# EAGLE design 18650_1S3P_Smart (EAGLE 9.6.2)
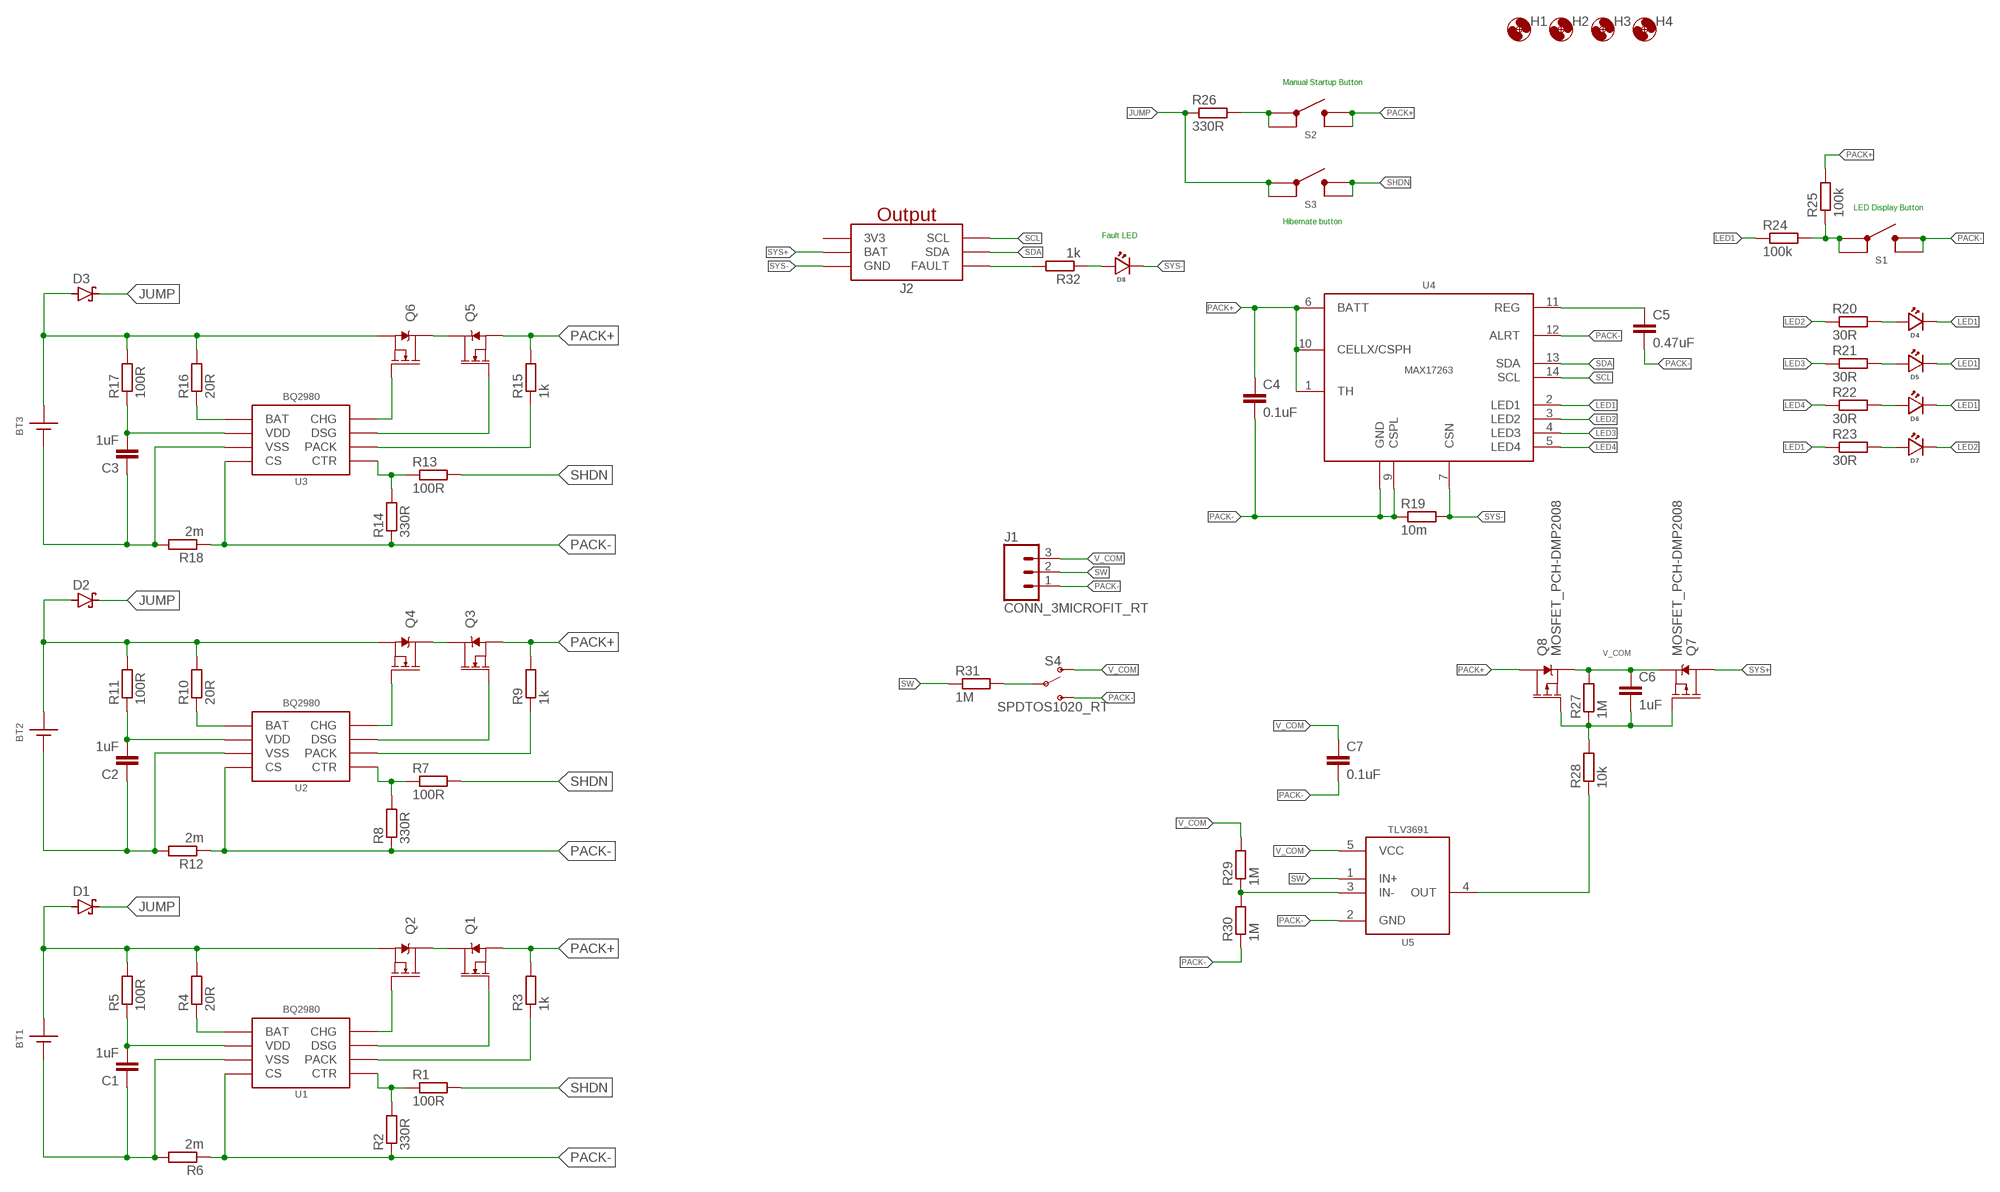
[diagram p0: schematic, sheet 1]

## Parts
BT1  186501042P_NOSILK  [BATT_1042P_NOSILK]
BT2  186501042P_NOSILK  [BATT_1042P_NOSILK]
BT3  186501042P_NOSILK  [BATT_1042P_NOSILK]
C1  1uF  C-EU1UFC0603  [C0603]
C2  1uF  C-EU1UFC0603  [C0603]
C3  1uF  C-EU1UFC0603  [C0603]
C4  0.1uF  C-EU0.1UFC0603  [C0603]
C5  0.47uF  C-EU0.47UFC0603  [C0603]
C6  1uF  C-EU1UFC0603  [C0603]
C7  0.1uF  C-EU0.1UFC0603  [C0603]
D1  DIODE_SCHOTTKYSOD-323  [SOD323-R]
D2  DIODE_SCHOTTKYSOD-323  [SOD323-R]
D3  DIODE_SCHOTTKYSOD-323  [SOD323-R]
D4  LED1206_BOTTOM  [LED_1206_BOTTOM]
D5  LED1206_BOTTOM  [LED_1206_BOTTOM]
D6  LED1206_BOTTOM  [LED_1206_BOTTOM]
D7  LED1206_BOTTOM  [LED_1206_BOTTOM]
D8  LED1206_BOTTOM  [LED_1206_BOTTOM]
H1  MOUNTING_HOLE2_NP  [2_56]
H2  MOUNTING_HOLE2_NP  [2_56]
H3  MOUNTING_HOLE2_NP  [2_56]
H4  MOUNTING_HOLE2_NP  [2_56]
J1  CONN_3MICROFIT_RT  [1X3_MICROFIT_RT]
J2  GEMS_POWER_PLUGOUTPUT  [2X3_MICROFIT_RT]
Q1  MOSFET-NCH-AON7522E  [DFN3X3A_8L_EP1_P]
Q2  MOSFET-NCH-AON7522E  [DFN3X3A_8L_EP1_P]
Q3  MOSFET-NCH-AON7522E  [DFN3X3A_8L_EP1_P]
Q4  MOSFET-NCH-AON7522E  [DFN3X3A_8L_EP1_P]
Q5  MOSFET-NCH-AON7522E  [DFN3X3A_8L_EP1_P]
Q6  MOSFET-NCH-AON7522E  [DFN3X3A_8L_EP1_P]
Q7  MOSFET_PCH-DMP2008  [POWERDI3333-8]
Q8  MOSFET_PCH-DMP2008  [POWERDI3333-8]
R1  100R  R-EU_100R0603  [R0603]
R2  330R  R-EU_330R0603  [R0603]
R3  1k  R-EU_1KR0603  [R0603]
R4  20R  R-EU_20R0603  [R0603]
R5  100R  R-EU_100R0603  [R0603]
R6  2m  R-EU_0.002R0805  [R0805]
R7  100R  R-EU_100R0603  [R0603]
R8  330R  R-EU_330R0603  [R0603]
R9  1k  R-EU_1KR0603  [R0603]
R10  20R  R-EU_20R0603  [R0603]
R11  100R  R-EU_100R0603  [R0603]
R12  2m  R-EU_0.002R0805  [R0805]
R13  100R  R-EU_100R0603  [R0603]
R14  330R  R-EU_330R0603  [R0603]
R15  1k  R-EU_1KR0603  [R0603]
R16  20R  R-EU_20R0603  [R0603]
R17  100R  R-EU_100R0603  [R0603]
R18  2m  R-EU_0.002R0805  [R0805]
R19  10m  R-EU_0.01R0805  [R0805]
R20  30R  R-EU_30R0603  [R0603]
R21  30R  R-EU_30R0603  [R0603]
R22  30R  R-EU_30R0603  [R0603]
R23  30R  R-EU_30R0603  [R0603]
R24  100k  R-EU_100KR0603  [R0603]
R25  100k  R-EU_100KR0603  [R0603]
R26  330R  R-EU_330R0603  [R0603]
R27  1M  R-EU_1MR0603  [R0603]
R28  10k  R-EU_10KR0603  [R0603]
R29  1M  R-EU_1MR0603  [R0603]
R30  1M  R-EU_1MR0603  [R0603]
R31  1M  R-EU_1MR0603  [R0603]
R32  1k  R-EU_1KR0603  [R0603]
S1  BUTTON6X6_TH  [SWITCH_6MM_TH]
S2  BUTTON6X6_TH  [SWITCH_6MM_TH]
S3  BUTTON6X6_TH  [SWITCH_6MM_TH]
S4  SPDTOS1020_RT  [OS102011MA1QN1]
U1  BQ2980RUG  [RUG_S-PQFP-N8]
U2  BQ2980RUG  [RUG_S-PQFP-N8]
U3  BQ2980RUG  [RUG_S-PQFP-N8]
U4  MAX17263  [DFN_14_3X3]
U5  TLV3691DCK  [DCK_R-PDSO-G5]

## Nets
JUMP: D1.C D2.C D3.C R26.1 S3.1 S3.2
LED1: D4.CATHODE D5.CATHODE D6.CATHODE R23.1 R24.1 U4.2(LED1)
LED2: D7.CATHODE R20.1 U4.3(LED2)
LED3: R21.1 U4.4(LED3)
LED4: R22.1 U4.5(LED4)
N$1: Q1.D Q2.D
N$2: Q2.G U1.8(CHG)
N$3: Q1.G U1.7(DSG)
N$4: R1.1 R2.2 U1.5(CTR)
N$5: R3.1 U1.6(PACK)
N$6: BT1.BATT+(+) D1.A Q2.S@1(S) Q2.S@2(S) Q2.S@3(S) R4.2 R5.2
N$7: C1.2 R5.1 U1.2(VDD)
N$8: R4.1 U1.1(BAT)
N$9: BT1.BATT-(-) C1.1 R6.2 U1.3(VSS)
N$10: Q3.D Q4.D
N$11: Q4.G U2.8(CHG)
N$12: Q3.G U2.7(DSG)
N$13: R9.1 U2.6(PACK)
N$14: R7.1 R8.2 U2.5(CTR)
N$15: BT2.BATT+(+) D2.A Q4.S@1(S) Q4.S@2(S) Q4.S@3(S) R10.2 R11.2
N$16: C2.2 R11.1 U2.2(VDD)
N$17: R10.1 U2.1(BAT)
N$18: BT2.BATT-(-) C2.1 R12.2 U2.3(VSS)
N$19: Q5.D Q6.D
N$20: Q6.G U3.8(CHG)
N$21: Q5.G U3.7(DSG)
N$22: R15.1 U3.6(PACK)
N$23: R13.1 R14.2 U3.5(CTR)
N$24: BT3.BATT+(+) D3.A Q6.S@1(S) Q6.S@2(S) Q6.S@3(S) R16.2 R17.2
N$25: C3.2 R17.1 U3.2(VDD)
N$26: R16.1 U3.1(BAT)
N$27: BT3.BATT-(-) C3.1 R18.2 U3.3(VSS)
N$28: D4.ANODE R20.2
N$29: D5.ANODE R21.2
N$30: D6.ANODE R22.2
N$31: D7.ANODE R23.2
N$32: R24.2 R25.1 S1.1 S1.2
N$33: C5.1 U4.11(REG)
N$34: R26.2 S2.1 S2.2
N$35: R31.2 S4.2(P)
N$36: C6.2 Q7.4(G) Q8.4(G) R27.1 R28.2
N$37: R28.1 U5.4(OUT)
N$38: J2.1(FAULT) R32.2
N$41: R29.1 R30.2 U5.3(IN-)
N$42: D8.ANODE R32.1
PACK+: C4.1 Q1.S@1(S) Q1.S@2(S) Q1.S@3(S) Q3.S@1(S) Q3.S@2(S) Q3.S@3(S) Q5.S@1(S) Q5.S@2(S) Q5.S@3(S) Q8.EP@1(D) Q8.EP@2(D) Q8.EP@3(D) Q8.EP@4(D) Q8.EP@5(D) R3.2 R9.2 R15.2 R25.2 S2.3 S2.4 U4.1(TH) U4.6(BATT) U4.10(CELLX/CSPH)
PACK-: C4.2 C5.2 C7.2 J1.1 R2.1 R6.1 R8.1 R12.1 R14.1 R18.1 R19.1 R30.1 S1.3 S1.4 S4.3(S) U1.4(CS) U2.4(CS) U3.4(CS) U4.8(GND) U4.9(CSPL) U4.12(ALRT) U4.EP(GND) U5.2(GND)
SCL: J2.4(SCL) U4.14(SCL)
SDA: J2.6(SDA) U4.13(SDA)
SHDN: R1.2 R7.2 R13.2 S3.3 S3.4
SW: J1.2 R31.1 U5.1(IN+)
SYS+: J2.3(BAT) Q7.EP@1(D) Q7.EP@2(D) Q7.EP@3(D) Q7.EP@4(D) Q7.EP@5(D)
SYS-: D8.CATHODE J2.2(GND) R19.2 U4.7(CSN)
V_COM: C6.1 C7.1 J1.3 Q7.1(S) Q7.2(S) Q7.3(S) Q8.1(S) Q8.2(S) Q8.3(S) R27.2 R29.2 S4.1(O) U5.5(VCC)

## Notes on the sheet
- Manual Startup Button
- LED Display Button
- Hibernate button
- Fault LED

## Power pins joined to a net without a drawn wire
3V3: J2.5(3V3)

## Library data of the parts
BT1-BT3 = bschulz:18650: Battery Holder 18650 form factor Variant for with or without circuit protection (length varries depending on this); DIGIKEY: 36-1042P-ND; MF: Keystone; MPN: 1042P
C1-C3 C6 = bschulz_passives:C-EU: CAPACITOR, European symbol; DIGIKEY: 587-1251-1-ND; MF: Yaiyo Yuden; MPN: EMK107BJ105KA-T
C4 C7 = bschulz_passives:C-EU: CAPACITOR, European symbol; DIGIKEY: 490-6051-1-ND; MF: Murata; MPN: GCM188R71E104KA57D
C5 = bschulz_passives:C-EU: CAPACITOR, European symbol; DIGIKEY: 1276-2083-1-ND; MF: Samsung; MPN: CL10B474KA8NNNC
D1-D3 = bschulz:DIODE_SCHOTTKY: Generic Shottky Diode; DIGIKEY: BAT54WS-FDICT-ND; MF: Diodes Inc; MPN: BAT54WS-7-F
D4-D8 = bschulz:LED: Genaric LED
H1-H4 = bschulz:MOUNTING_HOLE: Genaric Mechanical Mounting Hole Hole diameter based on max body diameter + 15% Keepout ring is for diameter of socket cap screw (minimum required clearance) TPlace ring is for diameter of pan head screw (recomended clearance) Specifications: Socket Cap Button Head Socket Cap Pan Head; DIGIKEY: DNP; MF: N/A; MPN: DNP
J1 = bschulz:CONN_3: Genaric 3 terminal header Digikey 2.54_SCREW 3.5_SCREW; DIGIKEY: WM1861-ND; MF: Molex; MPN: 0436500300
J2 = bschulz:GEMS_POWER_PLUG: Power Plug For GEMS Based Systems Both Input and Output versions; DIGIKEY: WM1815-ND; DISP: Output; MF: Molex; MPN: 0430450600
Q1-Q6 = bschulz:MOSFET-NCH: N-channel MOSFETs Voltage controlled devices that allow control of high current outputs. SparkFun Products: SparkFun OpenScale <https://www.sparkfun.com/products/13261> SparkFun Digital Sandbox <https://www.sparkfun.com/products/12651> SparkFun Monster Moto Shield <https://www.sparkfun.com/products/10182> SparkFun MOSFET Power Controller <https://www.sparkfun.com/products/11214>; DIGIKEY: 785-1505-1-ND; MF: Alpha & Omega; MPN: AON7522E
Q7 Q8 = bschulz:MOSFET_PCH: P-channel MOSFETs Voltage controlled devices that allow control of high current outputs. SparkFun Products: SparkFun ESP32 Thing <https://www.sparkfun.com/products/13907> SparkFun ESP8266 Thing <https://www.sparkfun.com/products/13231>
R1 R5 R7 R11 R13 R17 = bschulz_passives:R-EU_: RESISTOR, European symbol Digikey Parts: Yageo, 0402 Yageo, 0603 Panasonic, 0603 Panasonic, precision, 0603 Panasonic, 0805 Rohm, current sense Vishay, pulse proof automotive; DIGIKEY: 311-100HRCT-ND; MF: Yageo; MPN: RC0603FR-07100RL; VALUE_PART: 100
R2 R8 R14 R26 = bschulz_passives:R-EU_: RESISTOR, European symbol Digikey Parts: Yageo, 0402 Yageo, 0603 Panasonic, 0603 Panasonic, precision, 0603 Panasonic, 0805 Rohm, current sense Vishay, pulse proof automotive; DIGIKEY: 311-330HRCT-ND; MF: Yageo; MPN: RC0603FR-07330RL; VALUE_PART: 330
R3 R9 R15 R32 = bschulz_passives:R-EU_: RESISTOR, European symbol Digikey Parts: Yageo, 0402 Yageo, 0603 Panasonic, 0603 Panasonic, precision, 0603 Panasonic, 0805 Rohm, current sense Vishay, pulse proof automotive; DIGIKEY: 311-1KLDCT-ND; MF: Yageo; MPN: AC0603FR-071KL; VALUE_PART: 1k
R4 R10 R16 = bschulz_passives:R-EU_: RESISTOR, European symbol Digikey Parts: Yageo, 0402 Yageo, 0603 Panasonic, 0603 Panasonic, precision, 0603 Panasonic, 0805 Rohm, current sense Vishay, pulse proof automotive; DIGIKEY: 311-20.0HRCT-ND; MF: Yageo; MPN: RC0603FR-0720RL; VALUE_PART: 20
R6 R12 R18 = bschulz_passives:R-EU_: RESISTOR, European symbol Digikey Parts: Yageo, 0402 Yageo, 0603 Panasonic, 0603 Panasonic, precision, 0603 Panasonic, 0805 Rohm, current sense Vishay, pulse proof automotive; DIGIKEY: RHM.002AJCT-ND; MF: Rohm; MPN: PMR10EZPFV2L00
R19 = bschulz_passives:R-EU_: RESISTOR, European symbol Digikey Parts: Yageo, 0402 Yageo, 0603 Panasonic, 0603 Panasonic, precision, 0603 Panasonic, 0805 Rohm, current sense Vishay, pulse proof automotive; DIGIKEY: CRF0805-FZ-R010ELFCT-ND; MF: Bourns; MPN: CRF0805-FZ-R010ELF
R20-R23 = bschulz_passives:R-EU_: RESISTOR, European symbol Digikey Parts: Yageo, 0402 Yageo, 0603 Panasonic, 0603 Panasonic, precision, 0603 Panasonic, 0805 Rohm, current sense Vishay, pulse proof automotive; DIGIKEY: 311-30.0HRCT-ND; MF: Yageo; MPN: RC0603FR-0730RL; VALUE_PART: 30
R24 R25 = bschulz_passives:R-EU_: RESISTOR, European symbol Digikey Parts: Yageo, 0402 Yageo, 0603 Panasonic, 0603 Panasonic, precision, 0603 Panasonic, 0805 Rohm, current sense Vishay, pulse proof automotive; DIGIKEY: 311-100KHRCT-ND; MF: Yageo; MPN: RC0603FR-07100KL; VALUE_PART: 100k
R27 R29-R31 = bschulz_passives:R-EU_: RESISTOR, European symbol Digikey Parts: Yageo, 0402 Yageo, 0603 Panasonic, 0603 Panasonic, precision, 0603 Panasonic, 0805 Rohm, current sense Vishay, pulse proof automotive; DIGIKEY: P1.00MHCT-ND; MF: Panasonic; MPN: ERJ-3EKF1004V; VALUE_PART: 1M
R28 = bschulz_passives:R-EU_: RESISTOR, European symbol Digikey Parts: Yageo, 0402 Yageo, 0603 Panasonic, 0603 Panasonic, precision, 0603 Panasonic, 0805 Rohm, current sense Vishay, pulse proof automotive; DIGIKEY: 311-10.0KHRCT-ND; MF: Yageo; MPN: RC0603FR-0710KL; VALUE_PART: 10k
S1-S3 = bschulz:BUTTON: Genaric SPST Push button; DIGIKEY: 450-1650-ND; MF: TE Connectivity; MPN: 1825910-6
S4 = bschulz:SPDT: Genaric SPDT switch; DIGIKEY: CKN9559-ND; MF: C&K; MPN: OS102011MA1QN1
U1-U3 = bschulz:BQ2980: BQ2980 - Voltage, Current, Temperature Protectors with an Integrated High-Side NFET (BMS) Characteristics: Vpack: < 20V Vdd: 1.5V ~ 5.5V Vbat: 1.5V ~ 5.5V IQ: 1μA Normal, 0.1μA Shutdown Operating Temperature: -40°C to 85°C Digikey: 296-47578-1-ND <https://www.digikey.com/product-detail/en/texas-instruments/BQ298000RUGT/296-47578-1-ND/8111032>; DIGIKEY: 296-47578-1-ND; MF: TI; MOUSER: 595-BQ298000RUGT; MPN: BQ298000RUGT
U4 = bschulz:MAX17263: MAX17263 - Single/Multi-Cell Fuel Gauge with Integrated LED Control Characteristics: Vin: 2.3 ~ 4.9V IQ: 15μA typ ILSB: 1.5625μV VLSB: 78.125μV Operating Temperature: -40°C to 85°C Digikey: 175-MAX17263LETD+TCT-ND <https://www.digikey.com/en/products/detail/maxim-integrated/MAX17263LETD-T/9833463>; DIGIKEY: 175-MAX17263LETD+TCT-ND; MF: Maxim; MPN: MAX17263LETD+T
U5 = bschulz:TLV3691: TLV3691 - Nanopower Analog Comparator Characteristics: Vin: 0.9V ~ 6.5V (± 0.45V ~ ± 3.25V) Response Time: 24us Push-Pull Output IQ: 75nA Operating Temperature: -40°C to 125°C Digikey: 296-37910-1-ND (DCK) <https://www.digikey.com/products/en/integrated-circuits-ics/linear-comparators/692?k=TLV3691&k=&pkeyword=TLV3691&sv=0&pv7=2&sf=0&FV=142c0371%2Cffe002b4&quantity=&ColumnSort=1000011&page=1&stock=1&pageSize=25> 296-37242-6-ND (DPF) <https://www.digikey.com/product-detail/en/texas-instruments/TLV3691IDPFR/296-37242-6-ND/4695352>; DIGIKEY: 296-37910-1-ND; MF: TI; MPN: TLV3691IDCKR

## Board
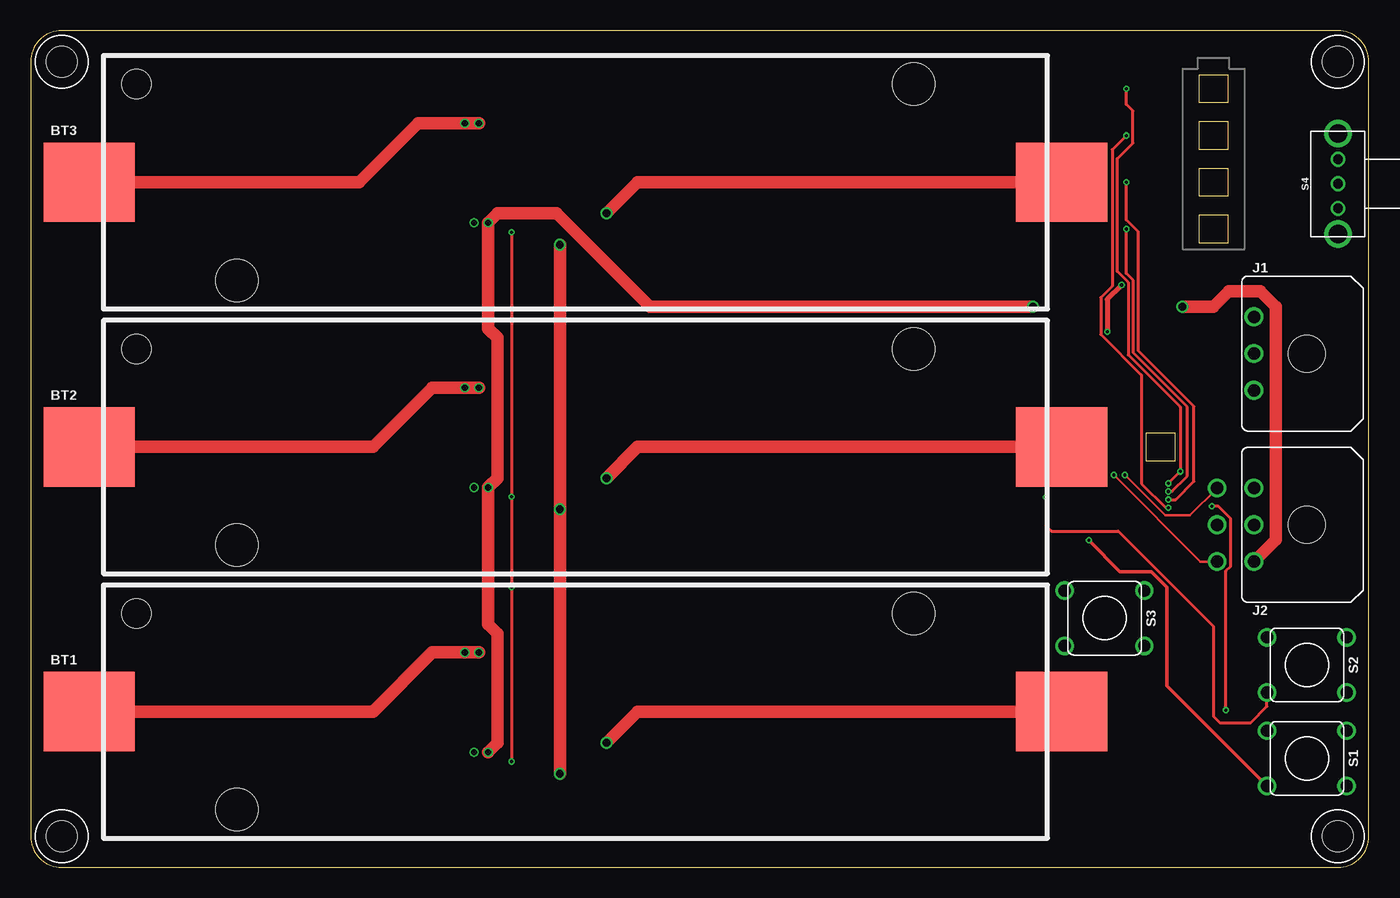
[diagram p1: board, top side]
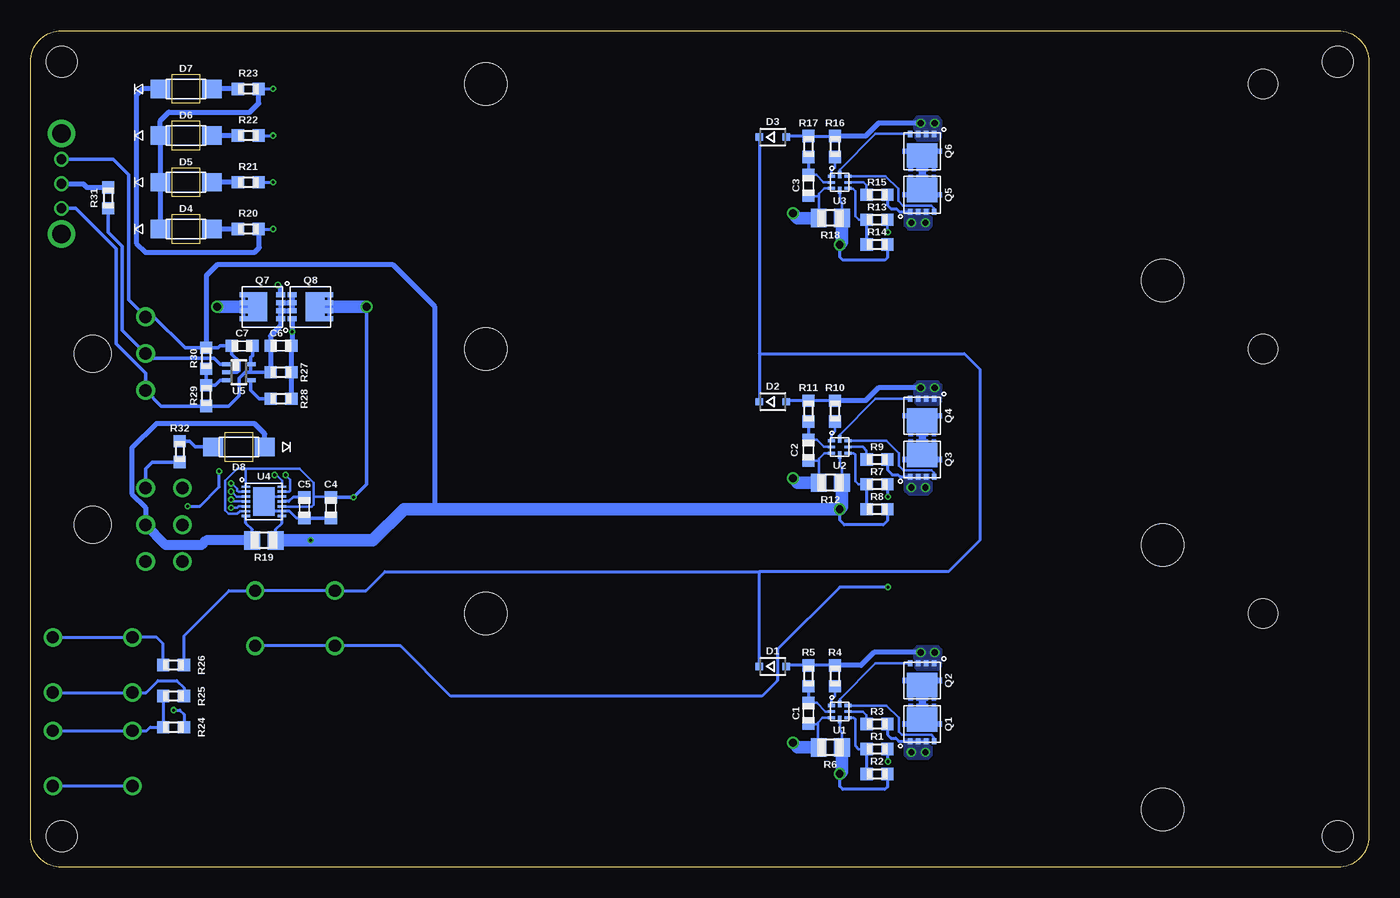
[diagram p2: board, bottom side, seen from below]

Size 109.2 x 68.25 mm. Coordinates in mm from the lower left corner, seen from the top.
Outline: 106.66,68.25 2.54,68.25 arc90 0,65.71 0,2.54 arc90 2.54,0 106.66,0 arc90 109.2,2.54 109.2,65.71 arc90 106.66,68.25
Copper layers (1*16): Top 0.035559375mm / dielectric 1.6mm / Bottom 0.035559375mm
Design rules "oshpark-2layer": minimum track width 6mil, minimum drill 10mil, track to track 6mil, track to pad 6mil, pad to pad 6mil, via to via 6mil, smd to smd 6mil, copper to edge 15mil, drill to drill 6mil, minimum pad ring 5mil, minimum via ring 5mil, stop-mask expansion 2.5mil, vias tented up to drill 0mil, thermal gap 10mil

### Footprints (pad centres in the part's own frame; a part is rotated, then mirrored left to right if it is on the bottom)
BATT_1042P_NOSILK = smd 7.46 x 6.47: BATT+ 39.67,0; BATT- -39.67,0 | hole 3.45: -27.6,-8; 27.6,8 | hole 2.39: 35.82,-8
C0603 = smd 1 x 1: 1 -0.85,0; 2 0.85,0
SOD323-R = smd 0.6 x 0.6: A 1.1,0; C -1.1,0
LED_1206_BOTTOM = smd 1.6 x 1.5: ANODE 2.1,0; CATHODE -2.1,0
2_56 = hole 2.5: 0,0
1X3_MICROFIT_RT = drill 1.02: 1 3,4.32; 2 0,4.32; 3 -3,4.32 | hole 3: 0,0
2X3_MICROFIT_RT = drill 1.02: 1 3,4.32; 2 0,4.32; 3 -3,4.32; 4 3,7.32; 5 0,7.32; 6 -3,7.32 | hole 3: 0,0
DFN3X3A_8L_EP1_P = smd 2.45 x 1.98: D 0,0.381 | smd 0.35 x 0.5: G 0.975,-1.4; S@1 -0.975,-1.4; S@2 -0.325,-1.4; S@3 0.325,-1.4
POWERDI3333-8 = smd 0.42 x 0.7: 1 -0.975,-1.5; 2 -0.325,-1.5; 3 0.325,-1.5; 4 0.975,-1.5; EP@1 0.975,1.5; EP@2 0.325,1.5; EP@3 -0.325,1.5; EP@4 -0.975,1.5 | smd 2.37 x 1.55: EP@5 0,0.381
R0603 = smd 1 x 1: 1 -0.85,0; 2 0.85,0
R0805 = smd 1.3 x 1.5: 1 -0.95,0; 2 0.95,0
SWITCH_6MM_TH = drill 1: 1 -3.25,2.25; 2 3.25,2.25; 3 -3.25,-2.25; 4 3.25,-2.25
OS102011MA1QN1 = drill 0.8: 1 -2,0; 2 0,0; 3 2,0 | drill 1.5: BODY@1 -4.1,0; BODY@2 4.1,0
RUG_S-PQFP-N8 = smd 0.55 x 0.25: 1 -0.675,0.5; 3 -0.675,-0.5; 5 0.675,-0.5; 7 0.675,0.5 | smd 0.55 x 0.2: 2 -0.675,0; 6 0.675,0 | smd 0.3 x 0.6: 4 0,-0.65; 8 0,0.65
DFN_14_3X3 = smd 0.7 x 0.2: 1 -1.475,1.2; 2 -1.475,0.8; 3 -1.475,0.4; 4 -1.475,0; 5 -1.475,-0.4; 6 -1.475,-0.8; 7 -1.475,-1.2; 8 1.475,-1.2; 9 1.475,-0.8; 10 1.475,-0.4; 11 1.475,0; 12 1.475,0.4; 13 1.475,0.8; 14 1.475,1.2 | smd 1.78 x 2.35: EP 0,0
DCK_R-PDSO-G5 = smd 0.35 x 0.8: 1 -0.65,-0.95; 2 0,-0.95; 3 0.65,-0.95; 4 0.65,0.95; 5 -0.65,0.95

### Placement (x,y rotation side)
BT1  44.45,12.7 180 top
BT2  44.45,34.29 180 top
BT3  44.45,55.88 180 top
C1  45.72,12.57 90 bottom
C2  45.72,34.04 90 bottom
C3  45.72,55.63 90 bottom
C4  84.71,29.34 270 bottom
C5  86.87,29.34 270 bottom
C6  88.77,42.55 0 bottom
C7  91.95,42.55 180 bottom
D1  48.64,16.38 0 bottom
D2  48.64,37.97 0 bottom
D3  48.64,59.56 0 bottom
D4  96.52,52.07 0 bottom
D5  96.52,55.88 0 bottom
D6  96.52,59.69 0 bottom
D7  96.52,63.5 0 bottom
D8  92.2,34.29 180 bottom
H1  2.54,65.71 0 top
H2  2.54,2.54 0 top
H3  106.66,2.54 0 top
H4  106.66,65.71 0 top
J1  104.14,41.91 90 top
J2  104.14,27.94 90 top
Q1  36.45,11.68 0 bottom
Q2  36.45,15.24 180 bottom
Q3  36.45,33.27 0 bottom
Q4  36.45,36.83 180 bottom
Q5  36.45,54.86 0 bottom
Q6  36.45,58.42 180 bottom
Q7  90.3,45.72 90 bottom
Q8  86.36,45.72 270 bottom
R1  40.13,9.65 0 bottom
R2  40.13,7.62 180 bottom
R3  40.13,11.68 0 bottom
R4  43.56,15.62 90 bottom
R5  45.72,15.62 90 bottom
R6  43.94,9.78 180 bottom
R7  40.13,31.24 0 bottom
R8  40.13,29.21 180 bottom
R9  40.13,33.27 0 bottom
R10  43.56,37.21 90 bottom
R11  45.72,37.21 90 bottom
R12  43.94,31.37 180 bottom
R13  40.13,52.83 0 bottom
R14  40.13,50.8 180 bottom
R15  40.13,54.86 0 bottom
R16  43.56,58.8 90 bottom
R17  45.72,58.8 90 bottom
R18  43.94,52.96 180 bottom
R19  90.17,26.67 180 bottom
R20  91.44,52.07 180 bottom
R21  91.44,55.88 180 bottom
R22  91.44,59.69 180 bottom
R23  91.44,63.5 180 bottom
R24  97.54,11.43 180 bottom
R25  97.54,13.97 0 bottom
R26  97.54,16.51 180 bottom
R27  88.77,40.39 180 bottom
R28  88.77,38.23 0 bottom
R29  94.87,38.48 270 bottom
R30  94.87,41.53 270 bottom
R31  102.87,54.61 90 bottom
R32  97.03,33.91 270 bottom
S1  104.14,8.89 0 top
S2  104.14,16.51 0 top
S3  87.63,20.32 0 top
S4  106.68,55.75 90 top
U1  43.18,12.7 0 bottom
U2  43.18,34.29 0 bottom
U3  43.18,55.88 0 bottom
U4  90.17,29.84 0 bottom
U5  92.2,40.39 270 bottom

### Tracks (layer width: path | path; a pad name or v marks a point on that pad's centre or on a via)
JUMP
  Bottom 0.254: D1.C 49.74,24.13 | 49.74,24.13 80.28,24.13 81.84,22.57 S3.1 S3.2 93,22.57 96.69,18.88 R26.1 | D3.C 49.74,41.91 | 49.74,41.91 D2.C | 49.74,41.91 33.02,41.91 31.75,40.64 31.75,26.67 34.29,24.13 49.74,24.13
LED1  (via drill 0.25)
  Top 0.254: v89.41,63.5 89.41,62.23 89.94,61.7 89.94,59.08 88.67,57.81 88.67,48.61 89.56,47.72 89.56,41.81 93.81,37.55 v93.81,32.3 v92.84,31.32 | v97.54,12.83 97.54,24.18 97.92,24.56 97.92,28.45 96.9,29.46 v96.39,29.46
  Bottom 0.2: U4.2 92.24,30.64 92.33,30.74 92.33,30.87 92.78,31.32 v92.84,31.32
  Bottom 0.254: R23.1 v89.41,63.5 | v97.54,12.83 97.03,12.83 96.69,12.48 R24.1 | v96.39,29.46 95.38,29.46 93.81,31.03 v93.81,32.3
  Bottom 0.406: D4.CATHODE D5.CATHODE D6.CATHODE 98.62,60.89 97.92,61.59 91.31,61.59 90.59,62.32 R23.1
LED2  (via drill 0.25)
  Top 0.254: v92.84,30.66 93.14,30.66 94.39,31.9 94.39,37.56 89.97,41.98 89.97,47.89 89.41,48.45 v89.41,52.07
  Bottom 0.2: U4.3 92.37,30.25 92.78,30.66 v92.84,30.66
  Bottom 0.254: R20.1 v89.41,52.07
  Bottom 0.406: D7.CATHODE 100.08,63.5 100.58,62.99 100.58,50.93 99.82,50.16 90.93,50.16 90.55,50.55 90.55,52.03 R20.1
LED3  (via drill 0.25)
  Top 0.254: v92.84,30 93.44,30 94.92,31.48 94.92,37.6 90.37,42.15 90.37,51.86 89.41,52.82 v89.41,55.88
  Bottom 0.2: v92.84,30 92.69,29.84 U4.4
  Bottom 0.254: R21.1 v89.41,55.88
LED4  (via drill 0.25)
  Top 0.254: v89.41,59.69 88.27,58.55 88.27,47.42 87.33,46.48 87.33,43.47 90.65,40.14 90.65,31.3 92.62,29.34 v92.84,29.34
  Bottom 0.2: U4.5 92.22,29.45 92.33,29.34 v92.84,29.34
  Bottom 0.254: R22.1 v89.41,59.69
N$1
  Bottom 0.61: Q2.D Q1.D
N$2
  Bottom 0.2: U1.8 43.18,13.72 40.26,16.64 Q2.G
N$3
  Bottom 0.2: U1.7 39.36,13.2 38.35,12.19 38.35,11.05 38.1,10.79 35.69,10.79 35.47,10.58 Q1.G
N$4
  Bottom 0.2: U1.5 42.05,12.2 41.91,12.06 41.91,9.91 41.66,9.65 R1.1
  Bottom 0.254: R1.1 R2.2
N$5
  Bottom 0.2: U1.6 41.27,12.7 40.98,12.41 R3.1
N$6  (via drill 0.5)
  Top 1.016: BT1.BATT+ 27.94,12.7 32.77,17.53 v36.58,17.53
  Bottom 0.254: R4.2 R5.2 47.45,16.47 D1.A
  Bottom 0.406: R4.2 41.44,16.47 40.39,17.53 v36.58,17.53
  other vias: 35.43,17.53
  pour Bottom (no thermals): 37.08,17.78 37.08,16.38 36.83,16.13 35.18,16.13 34.92,16.38 34.92,17.78 35.18,18.03 36.83,18.03
N$7
  Bottom 0.2: C1.2 45.05,13.42 44.32,12.7 U1.2
  Bottom 0.254: R5.1 C1.2
N$8
  Bottom 0.2: U1.1 43.85,13.68 43.56,13.97 R4.1
N$9  (via drill 0.65)
  Top 1.016: BT1.BATT- 49.53,12.7 v46.99,10.16
  Bottom 0.2: U1.3 44.57,12.2 44.96,11.81 44.96,11.68 | 44.96,11.68 44.96,9.85 R6.2 | C1.1 45.68,11.68 44.96,11.68
  Bottom 1.016: R6.2 46.61,9.78 v46.99,10.16
N$10
  Bottom 0.61: Q4.D Q3.D
N$11
  Bottom 0.2: U2.8 43.18,35.31 40.26,38.23 Q4.G
N$12
  Bottom 0.2: U2.7 39.36,34.79 38.35,33.78 38.35,32.77 37.97,32.38 35.69,32.38 35.47,32.17 Q3.G
N$13
  Bottom 0.2: U2.6 41.27,34.29 40.98,34 R9.1
N$14
  Bottom 0.2: U2.5 42.05,33.79 41.91,33.66 41.91,31.5 41.66,31.24 R7.1
  Bottom 0.254: R7.1 R8.2
N$15  (via drill 0.5)
  Top 1.016: BT2.BATT+ 27.94,34.29 32.77,39.12 v36.58,39.12
  Bottom 0.254: R10.2 R11.2 47.45,38.06 D2.A
  Bottom 0.406: v36.58,39.12 40.01,39.12 41.07,38.06 R10.2
  other vias: 35.43,39.12
  pour Bottom (no thermals): 37.08,39.37 37.08,37.97 36.83,37.72 35.18,37.72 34.92,37.97 34.92,39.37 35.18,39.62 36.83,39.62
N$16
  Bottom 0.2: U2.2 44.45,34.29 45.05,34.89 C2.2
  Bottom 0.254: R11.1 C2.2
N$17
  Bottom 0.2: R10.1 43.56,35.56 43.85,35.27 U2.1
N$18  (via drill 0.65)
  Top 1.016: BT2.BATT- 49.53,34.29 v46.99,31.75
  Bottom 0.2: U2.3 44.44,33.79 44.89,33.34 44.89,33.19 | 44.89,33.19 R12.2 | C2.1 44.89,33.19
  Bottom 1.016: R12.2 46.61,31.37 v46.99,31.75
N$19
  Bottom 0.61: Q6.D Q5.D
N$20
  Bottom 0.2: U3.8 43.18,56.9 40.26,59.82 Q6.G
N$21
  Bottom 0.2: Q5.G 35.47,53.77 35.69,53.98 38.01,53.98 38.4,54.37 38.4,55.34 39.44,56.38 U3.7
N$22
  Bottom 0.2: R15.1 40.98,55.63 41.24,55.88 U3.6
N$23
  Bottom 0.2: U3.5 42.5,55.37 42.12,55.37 41.91,55.17 41.91,53.12 41.62,52.83 R13.1
  Bottom 0.254: R13.1 R14.2
N$24  (via drill 0.5)
  Top 1.016: BT3.BATT+ 26.8,55.88 31.62,60.71 v36.58,60.71
  Bottom 0.254: R16.2 R17.2 47.45,59.65 D3.A
  Bottom 0.406: v36.58,60.71 40.01,60.71 41.07,59.65 R16.2
  other vias: 35.43,60.71
  pour Bottom (no thermals): 37.08,60.96 37.08,59.56 36.83,59.31 35.18,59.31 34.92,59.56 34.92,60.96 35.18,61.21 36.83,61.21
N$25
  Bottom 0.2: C3.2 45.09,56.48 44.49,55.88 U3.2
  Bottom 0.254: R17.1 C3.2
N$26
  Bottom 0.2: R16.1 43.56,57.06 43.85,56.77 U3.1
N$27  (via drill 0.65)
  Top 1.016: BT3.BATT- 49.53,55.88 v46.99,53.34
  Bottom 0.2: R18.2 44.89,54.74 | 44.89,54.74 44.89,54.93 44.44,55.38 U3.3 | C3.1 45.68,54.74 44.89,54.74
  Bottom 1.016: v46.99,53.34 46.61,52.96 R18.2
N$28
  Bottom 0.406: R20.2 D4.ANODE
N$29
  Bottom 0.406: R21.2 D5.ANODE
N$30
  Bottom 0.406: R22.2 D6.ANODE
N$31
  Bottom 0.406: R23.2 D7.ANODE
N$32
  Bottom 0.254: R25.1 R24.2 99.44,11.43 99.73,11.14 100.33,11.14 S1.1 S1.2
N$33
  Bottom 0.254: C5.1 87.8,30.19 88.14,29.84 U4.11
N$34
  Bottom 0.254: S2.2 S2.1 98.9,18.76 98.39,18.25 R26.2
N$35
  Bottom 0.406: S4.2 104.9,55.75 104.61,55.46 R31.2
N$36  (via drill 0.25)
  Top 0.406: v89.03,47.5 87.86,46.33 v87.86,43.69
  Bottom 0.406: R28.2 R27.1 C6.2 87.86,42.61 v87.86,43.69 Q8.4 | Q7.4 88.8,47.27 v89.03,47.5
N$37
  Bottom 0.305: U5.4 91.25,38.93 90.55,38.23 R28.1
N$38
  Bottom 0.305: R32.2 99.28,33.06 99.82,32.51 J2.1
N$41
  Bottom 0.305: R30.2 R29.1 94.15,39.33 93.74,39.74 U5.3
N$42
  Bottom 0.305: R32.1 96.23,34.76 95.76,34.29 D8.ANODE
PACK+  (via drill 0.25, 0.5, 0.65)
  Top 0.254: v82.84,30.19 82.84,27.9 83.31,27.43 88.75,27.43 96.52,19.66 96.52,12.32 97.03,11.81 99.57,11.81 100.89,13.13 S2.3
  Top 1.016: v37.34,9.4 38.1,10.16 38.1,19.05 37.34,19.81 v37.34,30.99 38.1,31.75 38.1,43.18 37.34,43.94 v37.34,52.58 38.1,53.34 42.93,53.34 50.55,45.72 v81.79,45.72
  Bottom 0.2: U4.6 92.11,29.05 92.33,28.83 93.05,28.83 93.34,29.13 93.34,31.53 92.36,32.51 91.64,32.51 | 91.64,32.51 87.25,32.51 86.11,31.37 86.11,30.23 | 86.11,30.23 86.11,29.59 86.27,29.42 88.67,29.42 U4.10 | U4.1 91.64,32.51 | C4.1 84.75,30.23 86.11,30.23
  Bottom 0.254: R15.2 39.28,54.01 38.99,53.72 38.54,53.72 38.3,53.48 37.44,53.48 Q5.S@1 | R9.2 39.28,32.42 38.88,32.02 38.41,32.02 38.27,31.87 Q3.S@1 | R3.2 39.28,10.83 38.99,10.54 38.61,10.54 38.35,10.28 Q1.S@1 Q1.S@2 Q1.S@3 | S2.4 S2.3 99.79,14.26 98.81,15.24 97.28,15.24 96.69,14.64 R25.2
  Bottom 0.305: Q8.EP@3 Q8.EP@2 Q8.EP@1 | Q8.EP@3 Q8.EP@4 | Q8.EP@3 85.19,45.72 Q8.EP@5 | v81.79,45.72 81.79,31.24 v82.84,30.19 C4.1
  Bottom 1.016: v81.79,45.72 Q8.EP@5
  other vias: 36.2,52.58 36.2,30.99 36.2,9.4
  pour Bottom (no thermals): 37.59,53.98 37.85,53.72 37.85,52.32 37.59,52.07 35.94,52.07 35.69,52.32 35.69,53.72 35.94,53.98
  pour Bottom (no thermals): 37.85,32.26 37.85,30.73 37.59,30.48 35.94,30.48 35.69,30.73 35.69,32.38 35.81,32.51 37.59,32.51
  pour Bottom (no thermals): 37.85,10.79 37.85,9.14 37.59,8.89 35.94,8.89 35.69,9.14 35.69,10.79 35.81,10.92 37.72,10.92
PACK-  (via drill 0.25, 0.65)
  Top 0.305: S1.3 92.71,14.82 92.71,22.86 91.44,24.13 88.9,24.13 v86.36,26.67
  Top 1.016: v43.18,50.8 v43.18,29.21 v43.18,7.62
  Bottom 0.2: R18.1 42.99,54.17 43.18,54.36 U3.4 | U2.4 43.18,32.77 42.99,32.58 R12.1 | U1.4 43.18,11.18 42.99,10.99 R6.1 | U4.12 89.77,30.25 U4.EP
  Bottom 0.254: S1.4 S1.3 | R2.1 39.28,6.57 39.5,6.35 42.93,6.35 43.18,6.6 v43.18,7.62 | R8.1 39.28,28.28 39.62,27.94 42.8,27.94 43.18,28.32 v43.18,29.21 | R14.1 39.28,49.74 39.5,49.53 42.93,49.53 43.18,49.78 v43.18,50.8 | R19.1 89.22,27.56 88.69,28.08 U4.8 U4.9 | 89.94,29.84 U4.EP 90.17,29.08 90.13,29.05 U4.9 | C5.2 87.5,28.49 88.06,29.05 U4.9
  Bottom 0.305: S4.3 102.46,57.75 101.22,56.51 101.22,46.31 J1.1 99.14,44.91 96.61,42.38 R30.1 93.89,42.38 93.73,42.55 C7.2 92.8,41.87 92.2,41.27 92.2,40.51 92.33,40.39 U5.2 | C4.2 C5.2
  Bottom 0.406: 76.2,29.21 76.2,45.72 79.63,49.15 93.98,49.15 94.87,48.26 R30.1
  Bottom 1.016: R18.1 42.99,50.99 v43.18,50.8 | v43.18,7.62 42.99,7.81 R6.1 | R12.1 42.99,29.4 v43.18,29.21 76.2,29.21 78.74,29.21 81.28,26.67 v86.36,26.67 R19.1
SCL  (via drill 0.25)
  Top 0.2: J2.4 94.58,28.7 92.58,28.7 v89.28,32
  Bottom 0.2: v89.28,32 89.15,32 88.69,31.55 U4.14
SDA  (via drill 0.25)
  Top 0.2: J2.6 95.46,24.94 v88.39,32
  Bottom 0.2: U4.13 88.1,30.64 88.01,30.73 88.01,31.62 v88.39,32
SHDN  (via drill 0.25)
  Top 0.254: v39.24,51.82 v39.24,30.23 v39.24,22.86 v39.24,8.64
  Bottom 0.2: R13.2 39.28,51.85 v39.24,51.82
  Bottom 0.254: R7.2 39.28,30.27 v39.24,30.23 | R1.2 39.28,8.68 v39.24,8.64 | S3.4 S3.3 79.03,18.07 74.93,13.97 49.53,13.97 48.26,15.24 48.26,17.78 43.18,22.86 v39.24,22.86
SW
  Bottom 0.305: U5.1 93.74,41.04 94.23,41.53 99.44,41.53 J1.2 101.73,43.82 101.73,50.67 102.87,51.82 R31.1
SYS+  (via drill 0.65)
  Top 1.016: v93.98,45.72 96.52,45.72 97.79,46.99 100.33,46.99 101.6,45.72 101.6,26.72 J2.3
  Bottom 0.305: Q7.EP@4 Q7.EP@3 Q7.EP@2 | Q7.EP@2 Q7.EP@1 | Q7.EP@2 91.47,45.72 Q7.EP@5
  Bottom 1.016: Q7.EP@5 v93.98,45.72
SYS-
  Bottom 0.254: R19.2 91.12,27.56 91.64,28.08 U4.7
  Bottom 0.406: D8.CATHODE 90.1,35.37 90.93,36.2 98.93,36.2 100.94,34.19 100.94,30.48 99.82,29.36 J2.2
  Bottom 0.813: R19.2 94.87,26.67 95.25,26.29 98.17,26.29 J2.2
V_COM
  Bottom 0.305: S4.1 105.54,53.75 102.23,50.45 102.23,42.72 99.82,40.31 J1.3 98.54,37.63 R29.2 93.05,37.63 92.2,38.48 92.2,39.88 92.15,39.93 92.14,39.93 91.68,40.39 91.31,40.39 | C7.1 91.1,41.74 91.25,41.59 U5.5 91.25,40.45 91.31,40.39 | 91.31,40.39 R27.2
  Bottom 0.406: R27.2 C6.1 89.62,43.35 88.8,44.17 Q7.1 Q7.2 | Q7.2 Q7.3 Q8.2 | Q7.2 Q8.3 Q8.2 | Q8.1 Q8.2

### Text on the board
tDocu: OFF | CHARGE STAT | + | - | ON | EXT / SWITCH | FAULT | + | - | POWER OUT | SLEEP | JUMP | INFO | + | - | 1S3P - Smart - 18650 / Project Gonk / Bobby Schulz / v0.0
bDocu: INFO - Press to display battery charge state via CHARGE STAT LEDs / JUMP - Press to "jump start" system on first insertion of batteries. / System will start automatically if charger is applied / SLEEP - Press and hold for > 6s in order to place the device in shutdown for shipping or storage. / Must press JUMP or connect charger to start again